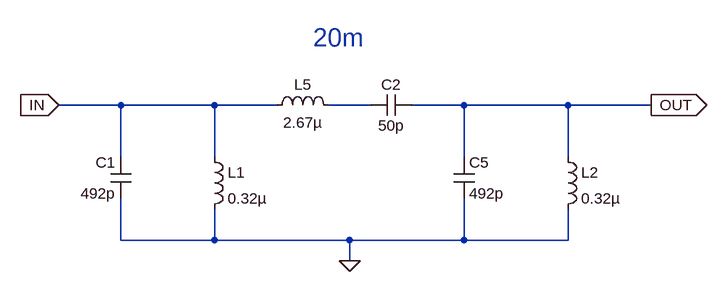
[diagram p0: schematic 20m BP.asc]
20m BP.asc, the LTspice schematic file:
Version 4
SHEET 1 880 680
WIRE -176 0 -272 0
WIRE -32 0 -176 0
WIRE 64 0 -32 0
WIRE 208 0 144 0
WIRE 352 0 272 0
WIRE 512 0 352 0
WIRE 640 0 512 0
WIRE -176 80 -176 0
WIRE -32 80 -32 0
WIRE 352 80 352 0
WIRE 512 80 512 0
WIRE -176 208 -176 144
WIRE -32 208 -32 160
WIRE -32 208 -176 208
WIRE 176 208 -32 208
WIRE 352 208 352 144
WIRE 352 208 176 208
WIRE 512 208 512 160
WIRE 512 208 352 208
WIRE 176 240 176 208
FLAG 176 240 0
FLAG -272 0 IN
IOPIN -272 0 In
FLAG 640 0 OUT
IOPIN 640 0 Out
SYMBOL cap -160 144 R180
WINDOW 0 24 56 Left 2
WINDOW 3 24 8 Left 2
SYMATTR InstName C1
SYMATTR Value 492p
SYMBOL cap 272 -16 R90
WINDOW 0 0 32 VBottom 2
WINDOW 3 32 32 VTop 2
SYMATTR InstName C2
SYMATTR Value 50p
SYMBOL ind -48 64 R0
SYMATTR InstName L1
SYMATTR Value 0.32µ
SYMBOL ind 496 64 R0
SYMATTR InstName L2
SYMATTR Value 0.32µ
SYMBOL cap 336 80 R0
SYMATTR InstName C5
SYMATTR Value 492p
SYMBOL ind 48 16 R270
WINDOW 0 32 56 VTop 2
WINDOW 3 5 56 VBottom 2
SYMATTR InstName L5
SYMATTR Value 2.67µ
TEXT 120 -104 Left 4 ;20m

The netlist it stands for:
* 20m BP.asc
C1 0 IN 492p
C2 OUT N001 50p
L1 IN 0 0.32µ
L2 OUT 0 0.32µ
C5 OUT 0 492p
L5 IN N001 2.67µ
* 20m
.backanno
.end